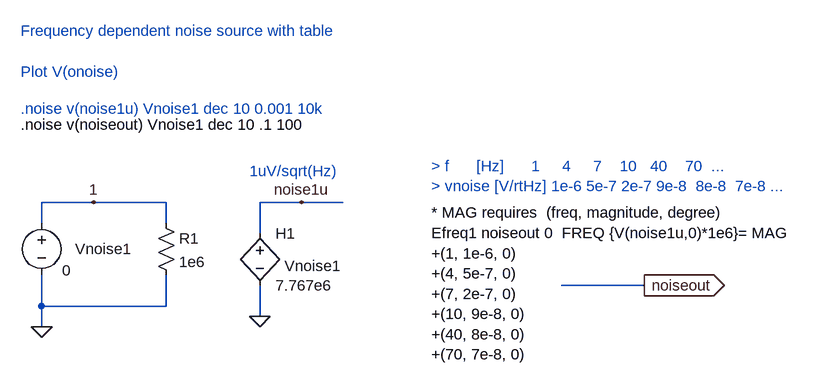
[diagram p0: schematic freq_dep_noise.asc]
freq_dep_noise.asc, the LTspice schematic file:
Version 4
SHEET 1 1176 680
WIRE 16 160 -64 160
WIRE 128 160 16 160
WIRE 336 160 272 160
WIRE 400 160 336 160
WIRE -64 192 -64 160
WIRE 128 192 128 160
WIRE 272 208 272 160
WIRE 864 288 736 288
WIRE -64 320 -64 272
WIRE 128 320 128 272
WIRE 128 320 -64 320
WIRE 272 336 272 288
WIRE -64 352 -64 320
FLAG -64 352 0
FLAG 272 336 0
FLAG 336 160 noise1u
FLAG 16 160 1
FLAG 864 288 noiseout
IOPIN 864 288 Out
SYMBOL h 272 192 R0
WINDOW 38 38 66 Left 0
SYMATTR SpiceModel Vnoise1
SYMATTR InstName H1
SYMATTR Value 7.767e6
SYMBOL voltage -64 176 R0
WINDOW 0 52 56 Left 0
WINDOW 3 32 89 Left 0
WINDOW 123 0 0 Left 0
WINDOW 39 0 0 Left 0
SYMATTR InstName Vnoise1
SYMATTR Value 0
SYMBOL res 112 176 R0
SYMATTR InstName R1
SYMATTR Value 1e6
TEXT -96 16 Left 0 ;.noise v(noise1u) Vnoise1 dec 10 0.001 10k
TEXT -96 -104 Left 0 ;Frequency dependent noise source with table\n \nPlot V(onoise)
TEXT 256 112 Left 0 ;1uV/sqrt(Hz)
TEXT 536 176 Left 0 !* MAG requires  (freq, magnitude, degree)\nEfreq1 noiseout 0  FREQ {V(noise1u,0)*1e6}= MAG\n+(1, 1e-6, 0)\n+(4, 5e-7, 0)  \n+(7, 2e-7, 0)  \n+(10, 9e-8, 0)  \n+(40, 8e-8, 0)  \n+(70, 7e-8, 0)
TEXT 536 104 Left 0 ;> f      [Hz]      1     4     7    10   40    70  ...\n> vnoise [V/rtHz] 1e-6 5e-7 2e-7 9e-8  8e-8  7e-8 ...
TEXT -96 40 Left 0 !.noise v(noiseout) Vnoise1 dec 10 .1 100

The netlist it stands for:
* freq_dep_noise.asc
H1 noise1u 0 Vnoise1 7.767e6
Vnoise1 1 0 0
R1 1 0 1e6
* .noise v(noise1u) Vnoise1 dec 10 0.001 10k
* Frequency dependent noise source with table
* Plot V(onoise)
* 1uV/sqrt(Hz)
* MAG requires  (freq, magnitude, degree)
Efreq1 noiseout 0  FREQ {V(noise1u,0)*1e6}= MAG
+(1, 1e-6, 0)
+(4, 5e-7, 0)
+(7, 2e-7, 0)
+(10, 9e-8, 0)
+(40, 8e-8, 0)
+(70, 7e-8, 0)
* > f      [Hz]      1     4     7    10   40    70  ...
* > vnoise [V/rtHz] 1e-6 5e-7 2e-7 9e-8  8e-8  7e-8 ...
.noise v(noiseout) Vnoise1 dec 10 .1 100
.backanno
.end